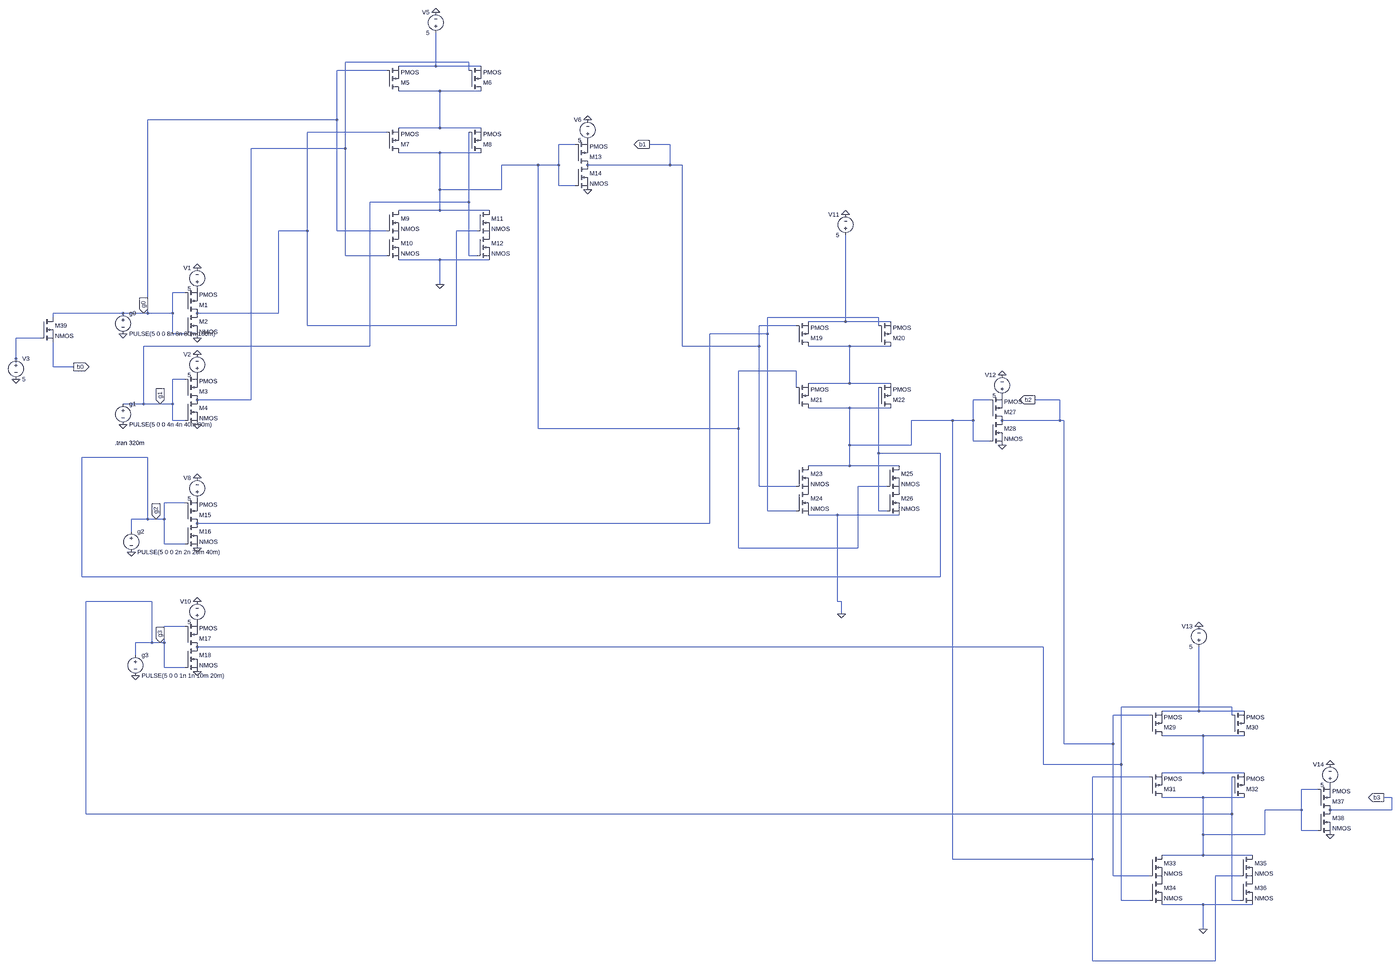
[diagram p0: schematic final vlsi xor.asc, whole sheet]
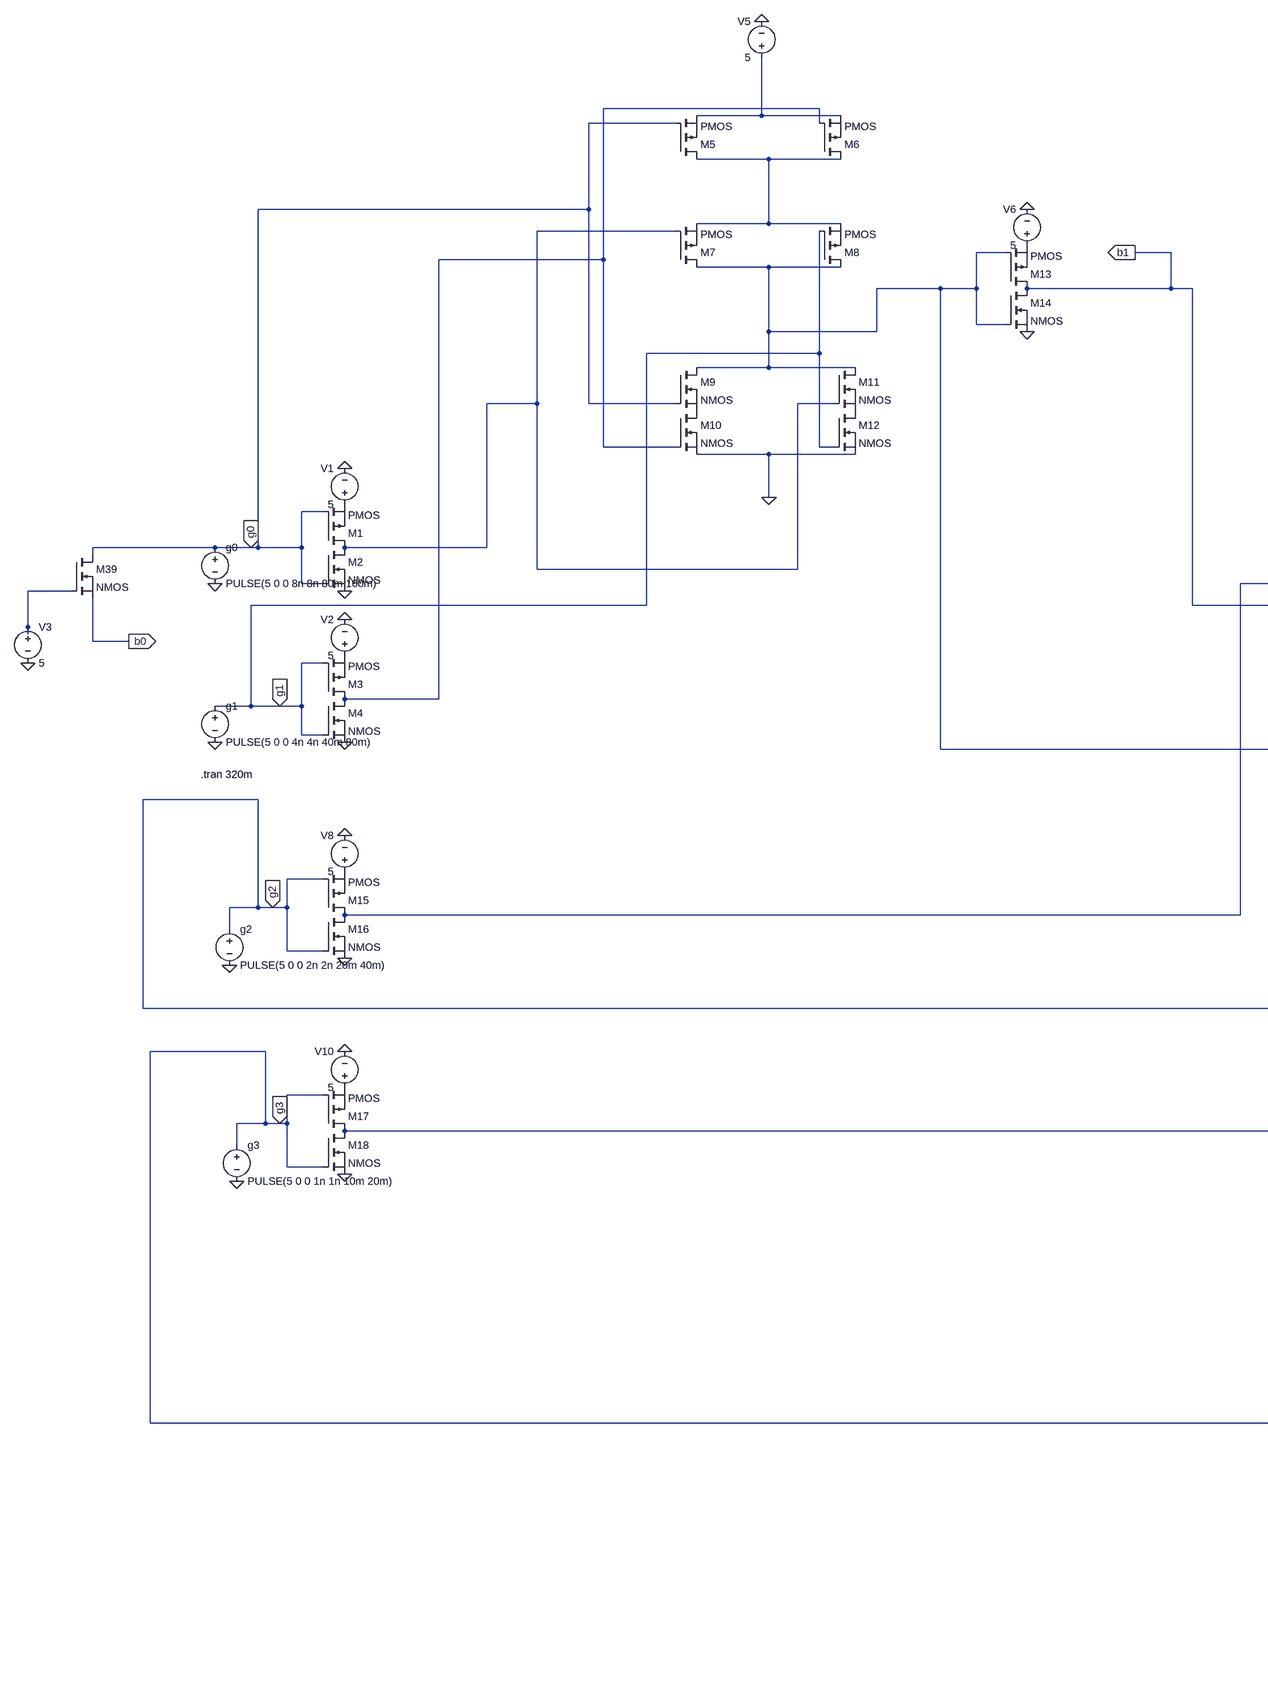
[diagram p1: schematic final vlsi xor.asc, part, row 1 of 1, column 1 of 2]
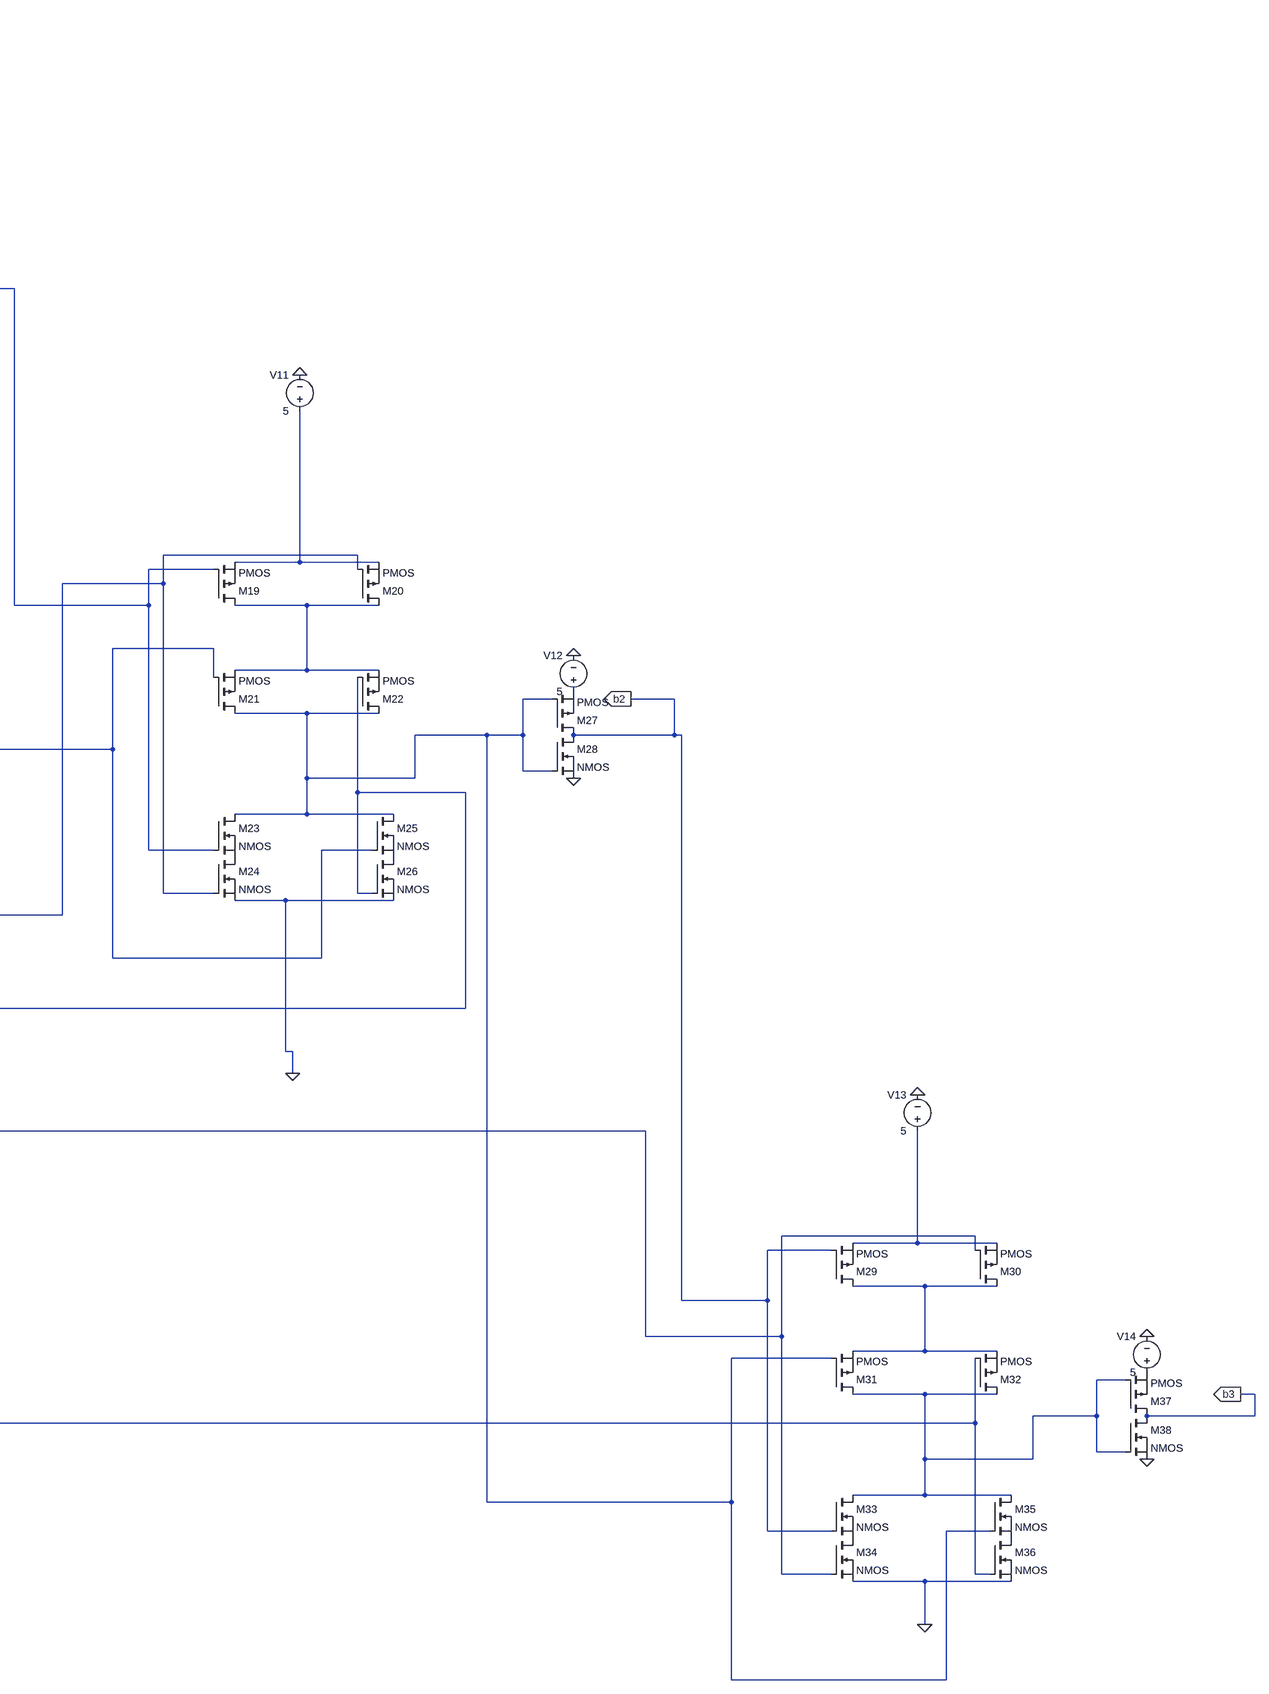
[diagram p2: schematic final vlsi xor.asc, part, row 1 of 1, column 2 of 2]
final vlsi xor.asc, the LTspice schematic file:
Version 4
SHEET 1 5928 2132
WIRE 1584 -1520 1104 -1520
WIRE 1456 -1504 1456 -1840
WIRE 1456 -1504 1312 -1504
WIRE 1632 -1504 1456 -1504
WIRE 1264 -1488 1072 -1488
WIRE 1584 -1488 1584 -1520
WIRE 1472 -1408 1312 -1408
WIRE 1632 -1408 1472 -1408
WIRE 1072 -1296 1072 -1488
WIRE 1072 -1296 -368 -1296
WIRE 1472 -1264 1472 -1408
WIRE 1472 -1264 1312 -1264
WIRE 1632 -1264 1472 -1264
WIRE 1264 -1248 912 -1248
WIRE 2016 -1200 1952 -1200
WIRE 2384 -1200 2304 -1200
WIRE 1104 -1184 1104 -1520
WIRE 1104 -1184 128 -1184
WIRE 1472 -1168 1312 -1168
WIRE 1632 -1168 1472 -1168
WIRE 1872 -1120 1712 -1120
WIRE 1952 -1120 1952 -1200
WIRE 1952 -1120 1872 -1120
WIRE 2384 -1120 2384 -1200
WIRE 2384 -1120 2064 -1120
WIRE 2432 -1120 2384 -1120
WIRE 1952 -1040 1952 -1120
WIRE 2016 -1040 1952 -1040
WIRE 1472 -1024 1472 -1168
WIRE 1712 -1024 1712 -1120
WIRE 1712 -1024 1472 -1024
WIRE 1584 -976 1584 -1248
WIRE 1584 -976 1200 -976
WIRE 1472 -944 1472 -1024
WIRE 1472 -944 1312 -944
WIRE 1664 -944 1472 -944
WIRE 912 -864 912 -1248
WIRE 912 -864 480 -864
WIRE 1072 -864 1072 -1296
WIRE 1264 -864 1072 -864
WIRE 1616 -864 1536 -864
WIRE 1104 -768 1104 -1184
WIRE 1264 -768 1104 -768
WIRE 1584 -768 1584 -976
WIRE 1616 -768 1584 -768
WIRE 1472 -752 1312 -752
WIRE 1664 -752 1472 -752
WIRE 1472 -656 1472 -752
WIRE -224 -624 -272 -624
WIRE -464 -544 -736 -544
WIRE -384 -544 -464 -544
WIRE -368 -544 -368 -1296
WIRE -368 -544 -384 -544
WIRE -272 -544 -272 -624
WIRE -272 -544 -368 -544
WIRE 480 -544 480 -864
WIRE 480 -544 -176 -544
WIRE -736 -528 -736 -544
WIRE 3664 -528 3184 -528
WIRE 3536 -512 3536 -848
WIRE 3536 -512 3392 -512
WIRE 3712 -512 3536 -512
WIRE 912 -496 912 -864
WIRE 1536 -496 1536 -864
WIRE 1536 -496 912 -496
WIRE 3344 -496 3152 -496
WIRE 3664 -496 3664 -528
WIRE -272 -464 -272 -544
WIRE -224 -464 -272 -464
WIRE 3184 -464 3184 -528
WIRE 3184 -464 2688 -464
WIRE -784 -448 -880 -448
WIRE 1200 -416 1200 -976
WIRE 1200 -416 -384 -416
WIRE 2432 -416 2432 -1120
WIRE 3152 -416 3152 -496
WIRE 3152 -416 2432 -416
WIRE 3552 -416 3392 -416
WIRE 3712 -416 3552 -416
WIRE -880 -368 -880 -448
WIRE -880 -352 -880 -368
WIRE -736 -336 -736 -432
WIRE -656 -336 -736 -336
WIRE 3344 -320 3072 -320
WIRE -224 -288 -272 -288
WIRE 3552 -272 3552 -416
WIRE 3552 -272 3392 -272
WIRE 3712 -272 3552 -272
WIRE 3344 -256 3344 -320
WIRE 128 -208 128 -1184
WIRE 128 -208 -176 -208
WIRE 4096 -208 4032 -208
WIRE 4368 -208 4272 -208
WIRE -384 -192 -384 -416
WIRE -384 -192 -464 -192
WIRE -320 -192 -384 -192
WIRE -272 -192 -272 -288
WIRE -272 -192 -320 -192
WIRE 3552 -176 3392 -176
WIRE 3712 -176 3552 -176
WIRE -272 -128 -272 -192
WIRE -224 -128 -272 -128
WIRE 3952 -128 3792 -128
WIRE 4032 -128 4032 -208
WIRE 4032 -128 3952 -128
WIRE 4368 -128 4368 -208
WIRE 4368 -128 4144 -128
WIRE 4384 -128 4368 -128
WIRE 1872 -96 1872 -1120
WIRE 3072 -96 3072 -320
WIRE 3072 -96 1872 -96
WIRE 4032 -48 4032 -128
WIRE 4096 -48 4032 -48
WIRE 3552 -32 3552 -176
WIRE 3792 -32 3792 -128
WIRE 3792 -32 3552 -32
WIRE 3664 0 3664 -256
WIRE 3904 0 3664 0
WIRE -368 16 -624 16
WIRE 3552 48 3552 -32
WIRE 3552 48 3392 48
WIRE 3744 48 3552 48
WIRE 3152 128 3152 -416
WIRE 3344 128 3152 128
WIRE 3696 128 3584 128
WIRE -224 192 -304 192
WIRE 3184 224 3184 -464
WIRE 3344 224 3184 224
WIRE 3664 224 3664 0
WIRE 3696 224 3664 224
WIRE 3504 240 3392 240
WIRE 3744 240 3504 240
WIRE -368 256 -368 16
WIRE -368 256 -432 256
WIRE -336 256 -368 256
WIRE -304 256 -304 192
WIRE -304 256 -336 256
WIRE 2688 272 2688 -464
WIRE 2688 272 -176 272
WIRE -432 304 -432 256
WIRE -304 352 -304 256
WIRE -224 352 -304 352
WIRE 3072 368 3072 -96
WIRE 3584 368 3584 128
WIRE 3584 368 3072 368
WIRE -624 480 -624 16
WIRE 3904 480 3904 0
WIRE 3904 480 -624 480
WIRE -352 576 -608 576
WIRE 3504 576 3504 240
WIRE 3520 576 3504 576
WIRE 3520 624 3520 576
WIRE -224 672 -304 672
WIRE -352 736 -352 576
WIRE -352 736 -416 736
WIRE -320 736 -352 736
WIRE -304 736 -304 672
WIRE -304 736 -320 736
WIRE 4304 752 -176 752
WIRE -416 784 -416 736
WIRE -304 832 -304 736
WIRE -224 832 -304 832
WIRE 5120 1072 4640 1072
WIRE 4992 1088 4992 752
WIRE 4992 1088 4848 1088
WIRE 5168 1088 4992 1088
WIRE 4800 1104 4608 1104
WIRE 5120 1104 5120 1072
WIRE 5008 1184 4848 1184
WIRE 5168 1184 5008 1184
WIRE 4384 1216 4384 -128
WIRE 4608 1216 4608 1104
WIRE 4608 1216 4384 1216
WIRE 4304 1296 4304 752
WIRE 4640 1296 4640 1072
WIRE 4640 1296 4304 1296
WIRE 5008 1328 5008 1184
WIRE 5008 1328 4848 1328
WIRE 5168 1328 5008 1328
WIRE 4800 1344 4528 1344
WIRE 5552 1392 5488 1392
WIRE 5008 1424 4848 1424
WIRE 5168 1424 5008 1424
WIRE 5840 1424 5808 1424
WIRE 5488 1472 5488 1392
WIRE 5488 1472 5248 1472
WIRE 5840 1472 5840 1424
WIRE 5840 1472 5600 1472
WIRE -608 1488 -608 576
WIRE 5120 1488 5120 1344
WIRE 5120 1488 -608 1488
WIRE 5488 1552 5488 1472
WIRE 5552 1552 5488 1552
WIRE 5008 1568 5008 1424
WIRE 5248 1568 5248 1472
WIRE 5248 1568 5008 1568
WIRE 5008 1648 5008 1568
WIRE 5008 1648 4848 1648
WIRE 5200 1648 5008 1648
WIRE 3952 1664 3952 -128
WIRE 4528 1664 4528 1344
WIRE 4528 1664 3952 1664
WIRE 4608 1728 4608 1216
WIRE 4800 1728 4608 1728
WIRE 5152 1728 5056 1728
WIRE 4640 1824 4640 1296
WIRE 4800 1824 4640 1824
WIRE 5120 1824 5120 1488
WIRE 5152 1824 5120 1824
WIRE 5008 1840 4848 1840
WIRE 5200 1840 5008 1840
WIRE 5008 1936 5008 1840
WIRE 4528 2064 4528 1664
WIRE 5056 2064 5056 1728
WIRE 5056 2064 4528 2064
FLAG -176 -448 0
FLAG -176 -112 0
FLAG -176 -720 0
FLAG -176 -384 0
FLAG -464 -464 0
FLAG -464 -112 0
FLAG 1472 -656 0
FLAG 1456 -1920 0
FLAG 2064 -1296 0
FLAG 2064 -1024 0
FLAG -432 384 0
FLAG -176 96 0
FLAG -176 368 0
FLAG -416 864 0
FLAG -176 576 0
FLAG -176 848 0
FLAG 5008 1936 0
FLAG 4992 672 0
FLAG 5600 1296 0
FLAG 5600 1568 0
FLAG 3536 -928 0
FLAG 4144 -304 0
FLAG 4144 -32 0
FLAG 3520 624 0
FLAG 2304 -1200 b1
IOPIN 2304 -1200 Out
FLAG 4272 -208 b2
IOPIN 4272 -208 Out
FLAG 5808 1424 b3
IOPIN 5808 1424 Out
FLAG -880 -288 0
FLAG -656 -336 b0
IOPIN -656 -336 Out
FLAG -384 -544 g0
IOPIN -384 -544 In
FLAG -320 -192 g1
IOPIN -320 -192 In
FLAG -336 256 g2
IOPIN -336 256 In
FLAG -320 736 g3
IOPIN -320 736 In
SYMBOL pmos -224 -544 M180
SYMATTR InstName M1
SYMBOL nmos -224 -544 R0
SYMATTR InstName M2
SYMBOL pmos -224 -208 M180
SYMATTR InstName M3
SYMBOL nmos -224 -208 R0
SYMATTR InstName M4
SYMBOL voltage -176 -624 R180
WINDOW 0 24 96 Left 2
WINDOW 3 24 16 Left 2
WINDOW 123 0 0 Left 0
WINDOW 39 0 0 Left 0
SYMATTR InstName V1
SYMATTR Value 5
SYMBOL voltage -176 -288 R180
WINDOW 0 24 96 Left 2
WINDOW 3 24 16 Left 2
WINDOW 123 0 0 Left 0
WINDOW 39 0 0 Left 0
SYMATTR InstName V2
SYMATTR Value 5
SYMBOL voltage -464 -560 R0
WINDOW 123 0 0 Left 0
WINDOW 39 0 0 Left 0
SYMATTR InstName g0
SYMATTR Value PULSE(5 0 0 8n 8n 80m 160m)
SYMBOL voltage -464 -208 R0
WINDOW 123 0 0 Left 0
WINDOW 39 0 0 Left 0
SYMATTR InstName g1
SYMATTR Value PULSE(5 0 0 4n 4n 40m 80m)
SYMBOL pmos 1264 -1408 M180
SYMATTR InstName M5
SYMBOL pmos 1584 -1408 M180
SYMATTR InstName M6
SYMBOL pmos 1264 -1168 M180
SYMATTR InstName M7
SYMBOL pmos 1584 -1168 M180
SYMATTR InstName M8
SYMBOL nmos 1264 -944 R0
SYMATTR InstName M9
SYMBOL nmos 1264 -848 R0
SYMATTR InstName M10
SYMBOL nmos 1616 -944 R0
SYMATTR InstName M11
SYMBOL nmos 1616 -848 R0
SYMATTR InstName M12
SYMBOL voltage 1456 -1824 R180
WINDOW 0 24 96 Left 2
WINDOW 3 24 16 Left 2
WINDOW 123 0 0 Left 0
WINDOW 39 0 0 Left 0
SYMATTR InstName V5
SYMATTR Value 5
SYMBOL pmos 2016 -1120 M180
SYMATTR InstName M13
SYMBOL nmos 2016 -1120 R0
SYMATTR InstName M14
SYMBOL voltage 2064 -1200 R180
WINDOW 0 24 96 Left 2
WINDOW 3 24 16 Left 2
WINDOW 123 0 0 Left 0
WINDOW 39 0 0 Left 0
SYMATTR InstName V6
SYMATTR Value 5
SYMBOL pmos -224 272 M180
SYMATTR InstName M15
SYMBOL nmos -224 272 R0
SYMATTR InstName M16
SYMBOL voltage -432 288 R0
WINDOW 123 0 0 Left 0
WINDOW 39 0 0 Left 0
SYMATTR InstName g2
SYMATTR Value PULSE(5 0 0 2n 2n 20m 40m)
SYMBOL voltage -176 192 R180
WINDOW 0 24 96 Left 2
WINDOW 3 24 16 Left 2
WINDOW 123 0 0 Left 0
WINDOW 39 0 0 Left 0
SYMATTR InstName V8
SYMATTR Value 5
SYMBOL pmos -224 752 M180
SYMATTR InstName M17
SYMBOL nmos -224 752 R0
SYMATTR InstName M18
SYMBOL voltage -416 768 R0
WINDOW 123 0 0 Left 0
WINDOW 39 0 0 Left 0
SYMATTR InstName g3
SYMATTR Value PULSE(5 0 0 1n 1n 10m 20m)
SYMBOL voltage -176 672 R180
WINDOW 0 24 96 Left 2
WINDOW 3 24 16 Left 2
WINDOW 123 0 0 Left 0
WINDOW 39 0 0 Left 0
SYMATTR InstName V10
SYMATTR Value 5
SYMBOL pmos 4800 1184 M180
SYMATTR InstName M29
SYMBOL pmos 5120 1184 M180
SYMATTR InstName M30
SYMBOL pmos 4800 1424 M180
SYMATTR InstName M31
SYMBOL pmos 5120 1424 M180
SYMATTR InstName M32
SYMBOL nmos 4800 1648 R0
SYMATTR InstName M33
SYMBOL nmos 4800 1744 R0
SYMATTR InstName M34
SYMBOL nmos 5152 1648 R0
SYMATTR InstName M35
SYMBOL nmos 5152 1744 R0
SYMATTR InstName M36
SYMBOL voltage 4992 768 R180
WINDOW 0 24 96 Left 2
WINDOW 3 24 16 Left 2
WINDOW 123 0 0 Left 0
WINDOW 39 0 0 Left 0
SYMATTR InstName V13
SYMATTR Value 5
SYMBOL pmos 5552 1472 M180
SYMATTR InstName M37
SYMBOL nmos 5552 1472 R0
SYMATTR InstName M38
SYMBOL voltage 5600 1392 R180
WINDOW 0 24 96 Left 2
WINDOW 3 24 16 Left 2
WINDOW 123 0 0 Left 0
WINDOW 39 0 0 Left 0
SYMATTR InstName V14
SYMATTR Value 5
SYMBOL pmos 3344 -416 M180
SYMATTR InstName M19
SYMBOL pmos 3664 -416 M180
SYMATTR InstName M20
SYMBOL pmos 3344 -176 M180
SYMATTR InstName M21
SYMBOL pmos 3664 -176 M180
SYMATTR InstName M22
SYMBOL nmos 3344 48 R0
SYMATTR InstName M23
SYMBOL nmos 3344 144 R0
SYMATTR InstName M24
SYMBOL nmos 3696 48 R0
SYMATTR InstName M25
SYMBOL nmos 3696 144 R0
SYMATTR InstName M26
SYMBOL voltage 3536 -832 R180
WINDOW 0 24 96 Left 2
WINDOW 3 24 16 Left 2
WINDOW 123 0 0 Left 0
WINDOW 39 0 0 Left 0
SYMATTR InstName V11
SYMATTR Value 5
SYMBOL pmos 4096 -128 M180
SYMATTR InstName M27
SYMBOL nmos 4096 -128 R0
SYMATTR InstName M28
SYMBOL voltage 4144 -208 R180
WINDOW 0 24 96 Left 2
WINDOW 3 24 16 Left 2
WINDOW 123 0 0 Left 0
WINDOW 39 0 0 Left 0
SYMATTR InstName V12
SYMATTR Value 5
SYMBOL nmos -784 -528 R0
SYMATTR InstName M39
SYMBOL voltage -880 -384 R0
WINDOW 123 0 0 Left 0
WINDOW 39 0 0 Left 0
SYMATTR InstName V3
SYMATTR Value 5
TEXT -496 -40 Left 2 !.tran 320m

The netlist it stands for:
* final vlsi xor.asc
M1 N004 g0 P001 P001 PMOS
M2 N004 g0 0 0 NMOS
M3 N001 g1 P002 P002 PMOS
M4 N001 g1 0 0 NMOS
V1 P001 0 5
V2 P002 0 5
V§g0 g0 0 PULSE(5 0 0 8n 8n 80m 160m)
V§g1 g1 0 PULSE(5 0 0 4n 4n 40m 80m)
M5 N003 g0 N002 N002 PMOS
M6 N003 N001 N002 N002 PMOS
M7 N005 N004 N003 N003 PMOS
M8 N005 g1 N003 N003 PMOS
M9 N005 g0 P003 P003 NMOS
M10 P003 N001 0 0 NMOS
M11 N005 N004 P004 P004 NMOS
M12 P004 g1 0 0 NMOS
V5 N002 0 5
M13 b1 N005 P005 P005 PMOS
M14 b1 N005 0 0 NMOS
V6 P005 0 5
M15 N006 g2 P006 P006 PMOS
M16 N006 g2 0 0 NMOS
V§g2 g2 0 PULSE(5 0 0 2n 2n 20m 40m)
V8 P006 0 5
M17 N011 g3 P007 P007 PMOS
M18 N011 g3 0 0 NMOS
V§g3 g3 0 PULSE(5 0 0 1n 1n 10m 20m)
V10 P007 0 5
M29 N013 b2 N012 N012 PMOS
M30 N013 N011 N012 N012 PMOS
M31 N014 N010 N013 N013 PMOS
M32 N014 g3 N013 N013 PMOS
M33 N014 b2 P008 P008 NMOS
M34 P008 N011 0 0 NMOS
M35 N014 N010 P009 P009 NMOS
M36 P009 g3 0 0 NMOS
V13 N012 0 5
M37 b3 N014 P010 P010 PMOS
M38 b3 N014 0 0 NMOS
V14 P010 0 5
M19 N009 b1 N007 N007 PMOS
M20 N009 N006 N007 N007 PMOS
M21 N010 N005 N009 N009 PMOS
M22 N010 g2 N009 N009 PMOS
M23 N010 b1 P011 P011 NMOS
M24 P011 N006 0 0 NMOS
M25 N010 N005 P012 P012 NMOS
M26 P012 g2 0 0 NMOS
V11 N007 0 5
M27 b2 N010 P013 P013 PMOS
M28 b2 N010 0 0 NMOS
V12 P013 0 5
M39 g0 N008 b0 b0 NMOS
V3 N008 0 5
.model NMOS NMOS
.model PMOS PMOS
.lib standard.mos
.tran 320m
.backanno
.end